# Altium project AGC_VCA821.PrjPcb
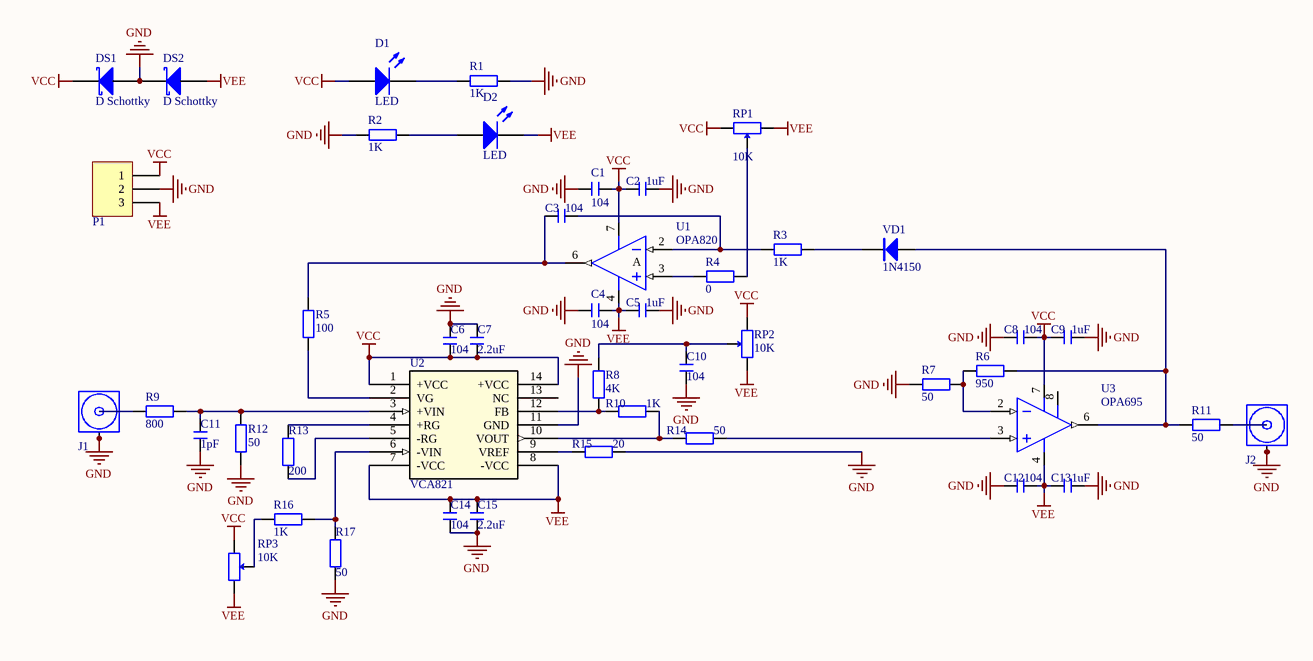
[diagram p0: AGC_VCA821.SchDoc]
1 sheet, 46 parts. Net scope: global (net labels, ports and power ports of the same name join across sheets).
Board file: AGC_VCA821.PcbDoc

## Sheet AGC_VCA821.SchDoc
size A4

### Parts
C1  104  [C 0603]
C2  1uF  [C 0603]
C3  104  [C 0603]
C4  104  [C 0603]
C5  1uF  [C 0603]
C6  104  [C 0603]
C7  2.2uF  [C 0603]
C8  104  [C 0603]
C9  1uF  [C 0603]
C10  104  [C 0603]
C11  1pF  [C 0603]
C12  104  [C 0603]
C13  1uF  [C 0603]
C14  104  [C 0603]
C15  2.2uF  [C 0603]
D1  LED  [LED_0805]
D2  LED  [LED_0805]
DS1  D Schottky  [DIODE-SMA]
DS2  D Schottky  [DIODE-SMA]
J1  COAX  [MCX5.08-5-H]  (value not drawn)
J2  COAX  [MCX5.08-5-H]  (value not drawn)
P1  Header 3  [HDR3X1_B2]  (value not drawn)
R1  1K  [R 0805]
R2  1K  [R 0805]
R3  1K  [R 0603]
R4  0  [R 0603]
R5  100  [R 0603]
R6  950  [R 0603]
R7  50  [R 0603]
R8  4K  [R 0603]
R9  800  [R 0603]
R10  1K  [R 0603]
R11  50  [R 0603]
R12  50  [R 0603]
R13  200  [R 0603]
R14  50  [R 0603]
R15  20  [R 0603]
R16  1K  [R 0603]
R17  50  [R 0603]
RP1  10K  [3296W]
RP2  10K  [3296W]
RP3  10K  [3296W]
U1  OPA820  [SOIC8_N]
U2  VCA821  [SOIC14_N]
U3  OPA695  [SOIC8_N]
VD1  1N4150  [MINI_MELF (LL34)]

### Nets
GND: C1.2 C2.1 C4.2 C5.1 C6.2 C7.2 C8.2 C9.1 C10.1 C11.1 C12.2 C13.1 C14.2 C15.1 DS1.1 DS2.2 J1.2(GND) J1.3(GND) J1.4(GND) J1.5(GND) J2.2(GND) J2.3(GND) J2.4(GND) J2.5(GND) P1.2 R1.2 R2.1 R7.2 R12.1 R15.2 R17.1 U2.11(GND)
VCC: C1.1 C2.2 C6.1 C7.1 C8.1 C9.2 D1.1(A) DS1.2 P1.1 RP1.3 RP2.1 RP3.3 U1.7(V+) U2.1(+VCC) U2.14(+VCC) U3.7(V+)
VEE: C4.1 C5.2 C12.1 C13.2 C14.1 C15.2 D2.2(K) DS2.1 P1.3 RP1.1 RP2.3 RP3.1 U1.4(V-) U2.7(-VCC) U2.8(-VCC) U3.4(V-)
NetC3_1: C3.1 R3.2 U1.2(-IN)
NetC3_2: C3.2 R5.1 U1.6(OUT)
NetC10_2: C10.2 R8.2 RP2.2
NetC11_2: C11.2 R9.1 R12.2 U2.3(+VIN)
NetD1_2: D1.2(K) R1.1
NetD2_1: D2.1(A) R2.2
NetJ1_1: J1.1(Signal) R9.2
NetJ2_1: J2.1(Signal) R11.1
NetR3_1: R3.1 VD1.2(K)
NetR4_1: R4.1 U1.3(+IN)
NetR4_2: R4.2 RP1.2
NetR5_2: R5.2 U2.2(VG)
NetR6_1: R6.1 R11.2 U3.6(OUT) VD1.1(A)
NetR6_2: R6.2 R7.1 U3.2(IN-)
NetR8_1: R8.1 R10.1 U2.12(FB)
NetR10_2: R10.2 R14.1 U2.10(VOUT)
NetR13_1: R13.1 U2.5(-RG)
NetR13_2: R13.2 U2.4(+RG)
NetR14_2: R14.2 U3.3(IN+)
NetR15_1: R15.1 U2.9(VREF)
NetR16_1: R16.1 R17.2 U2.6(-VIN)
NetR16_2: R16.2 RP3.2

Not connected (* = marked no-connect by the designer): U2 13(NC); U3 8(DIS)

### Notes on the sheet
- (in symbol OPA820) A

### Library data of the parts
C1-C15 = C: 无极性贴片电容; 版权归属: 源创客; BOM名称: 无极性贴片电容; 学习资源: www.ooocke.com
D1 D2 = LED: 发光二极管; Published: 8-Jun-2000; LatestRevisionDate: 08-Jul-2005; LatestRevisionNote: Mech Layer 1 removed.; PackageReference: LED; Publisher: Altium Limited
DS1 DS2 = D Schottky: Schottky Diode; Published: 8-Jun-2000; LatestRevisionDate: 17-Jul-2002; LatestRevisionNote: Re-released for DXP Platform.; PackageReference: SMB; Publisher: Altium Limited; PackageDescription: DO-214-AA/SMB; 2 C-Bend Leads; Body 5.3 x 3.6 mm, inc. leads (LxW); Code_JEDEC: DO-214-AA
P1 = Header 3: 接插件; LatestRevisionDate: 17-Jul-2002; LatestRevisionNote: Re-released for DXP Platform.; Publisher: Altium Limited
R1-R17 = R: 贴片电阻; 版权归属: 源创客; BOM名称: 贴片电阻; 学习资源: www.ooocke.com
RP1-RP3 = RP-ID: 插件单联电位器; BOM名称: 插件电位器; 版权归属: 源创客; 学习资源: www.ooocke.com
U1 = OPA820: 单位增益稳定低噪声电压反馈运算放大器
U2 = VCA821: 可变增益放大器 Ultra-Wideband, > 40-dB Gain Adjust Range, Linear in dB; Manufacturer: Texas Instruments; Manufacturer_Part_Number: vca821_d_14; INDUSTRY_STD_PKG_TYPE: SOIC; FAMILY_NAME: VARIABLE GAIN AMPLIFIER; PIN_COUNT: 14; PACKAGE_DESIGNATOR: D; Datasheet URL: http://www.ti.com/lit/gpn/VCA821; GENERIC_PART_NUMBER: VCA821; Vendor: Texas Instruments; RefDes: RefDes; Type: DEV; Value: Value
U3 = OPA695: OPA695 Ultra-Wideband, Current-Feedback Operational Amplifier With Disable
VD1 = 1N4148: 高速开关二极管; 版权归属: 源创客; BOM名称: 高速开关二极管; 学习资源: www.ooocke.com